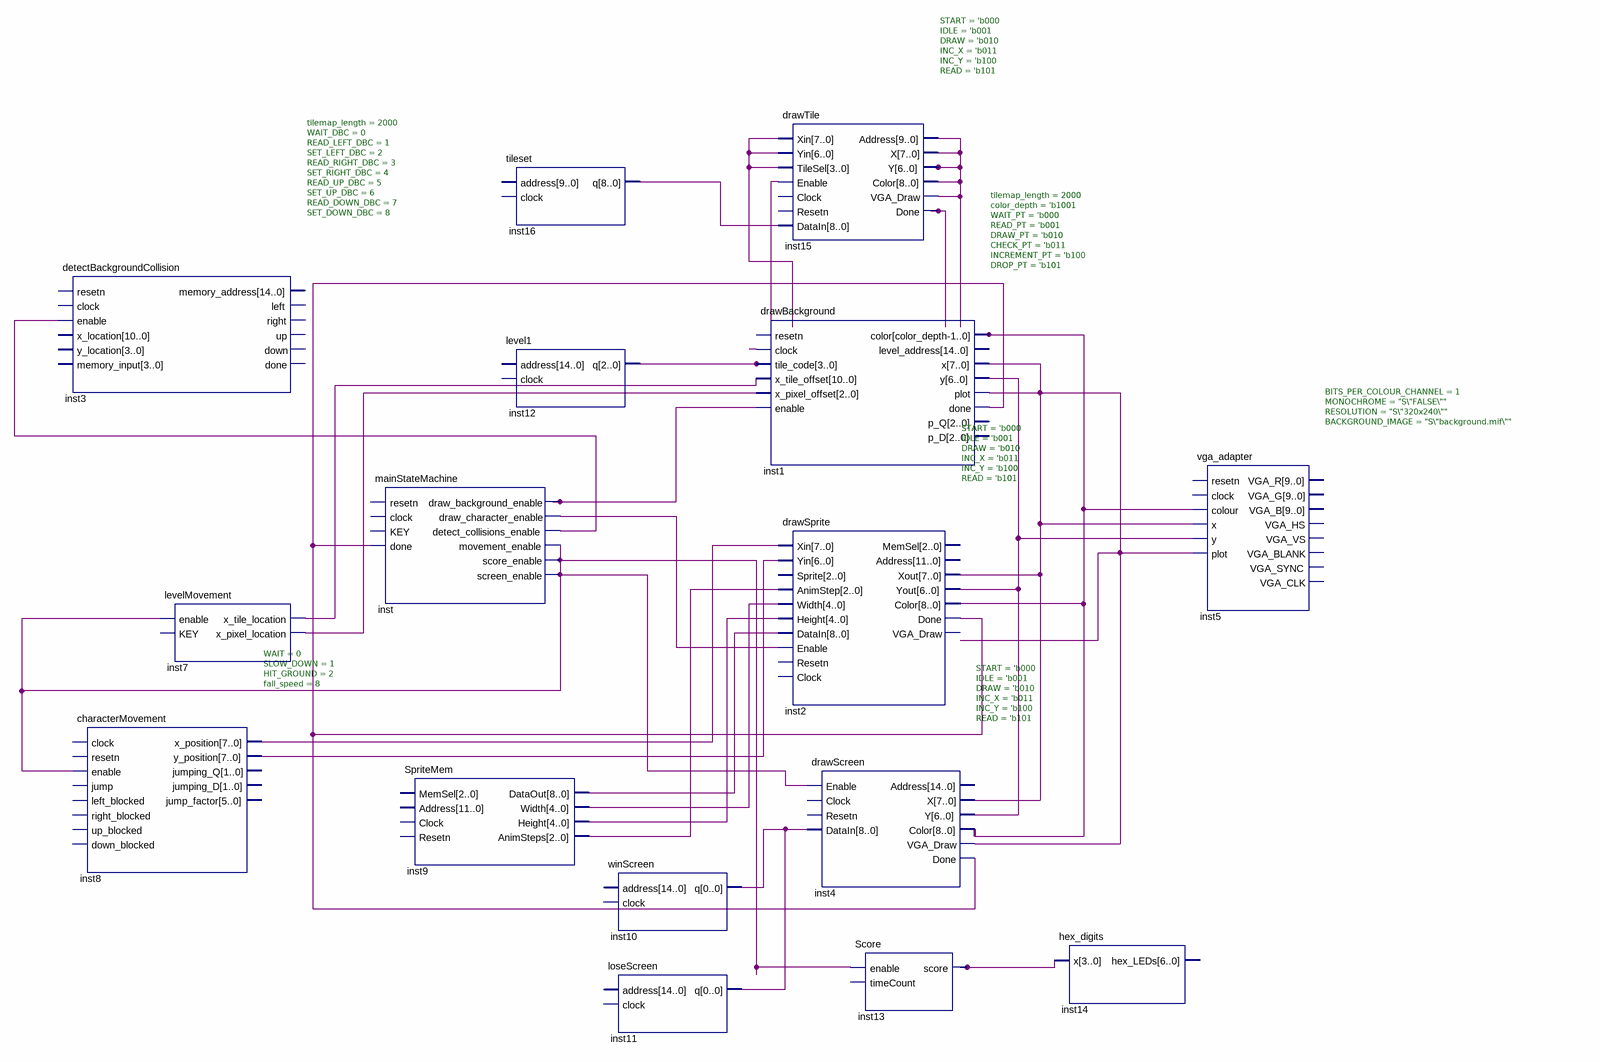
[diagram p0: schematic sheet]
// Quartus schematic Block.bdf as structural Verilog: 16 symbols, 0 pins
module Block (
);

  wire inst1_color, inst1_done, inst1_x, inst1_y, inst7_x_pixel_location, inst7_x_tile_location,
       inst8_y_position, inst10_q, inst12_q, inst13_score, inst15_address, inst15_done,
       inst_detect_collisions_enable, inst_draw_background_enable, inst_draw_character_enable,
       inst_movement_enable, undriven, undriven_2, undriven_3;
  wire [2:0] inst9_animsteps;
  wire [4:0] inst9_height, inst9_width;
  wire [7:0] inst8_x_position;
  wire [8:0] inst4_color, inst9_dataout, inst16_q;

  detectBackgroundCollision #(.tilemap_length(2000), .WAIT_DBC(0), .READ_LEFT_DBC(1), .SET_LEFT_DBC(2), .READ_RIGHT_DBC(3), .SET_RIGHT_DBC(4), .READ_UP_DBC(5), .SET_UP_DBC(6), .READ_DOWN_DBC(7), .SET_DOWN_DBC(8)) inst3 (.enable(inst_detect_collisions_enable));  // open: resetn, clock, x_location, y_location, memory_input, memory_address, left, right, up, down, done
  characterMovement #(.WAIT(0), .SLOW_DOWN(1), .HIT_GROUND(2), .fall_speed(8)) inst8 (
    .enable(inst_movement_enable), .x_position(inst8_x_position), .y_position(inst8_y_position));  // open: clock, resetn, jump, left_blocked, right_blocked, up_blocked, down_blocked, jumping_Q, jumping_D, jump_factor
  levelMovement inst7 (
    .enable(inst_movement_enable), .x_tile_location(inst7_x_tile_location),
    .x_pixel_location(inst7_x_pixel_location));  // open: KEY
  mainStateMachine inst (
    .done(inst1_done), .draw_background_enable(inst_draw_background_enable),
    .draw_character_enable(inst_draw_character_enable),
    .detect_collisions_enable(inst_detect_collisions_enable), .movement_enable(inst_movement_enable),
    .score_enable(inst_movement_enable), .screen_enable(inst_movement_enable));  // open: resetn, clock, KEY
  SpriteMem inst9 (
    .DataOut(inst9_dataout), .Width(inst9_width), .Height(inst9_height), .AnimSteps(inst9_animsteps));  // open: MemSel, Address, Clock, Resetn
  tileset inst16 (.q(inst16_q));  // open: address, clock
  level1 inst12 (.q(inst12_q));  // open: address, clock
  winScreen inst10 (.q(inst10_q));  // open: address, clock
  loseScreen inst11 (.q(inst10_q));  // open: address, clock
  drawBackground #(.tilemap_length(2000), .color_depth('b1001), .WAIT_PT('b000), .READ_PT('b001), .DRAW_PT('b010), .CHECK_PT('b011), .INCREMENT_PT('b100), .DROP_PT('b101)) inst1 (
    .clock(undriven), .tile_code({4{inst12_q}}), .x_tile_offset({11{inst7_x_tile_location}}),
    .x_pixel_offset({3{inst7_x_pixel_location}}), .enable(inst_draw_background_enable), .color(inst1_color),
    .x(inst1_x), .y(inst1_y), .plot(inst1_x), .done(inst1_done));  // open: resetn, level_address, p_Q, p_D
  drawTile #(.START('b000), .IDLE('b001), .DRAW('b010), .INC_X('b011), .INC_Y('b100), .READ('b101)) inst15 (
    .Xin({8{undriven_2}}), .Yin({7{undriven_2}}), .TileSel({4{undriven_2}}), .Enable(undriven_3),
    .DataIn(inst16_q), .Address(inst15_address), .X(inst15_address), .Y(inst15_address),
    .Color(inst15_address), .VGA_Draw(inst15_address), .Done(inst15_done));  // open: Clock, Resetn
  drawSprite #(.START('b000), .IDLE('b001), .DRAW('b010), .INC_X('b011), .INC_Y('b100), .READ('b101)) inst2 (
    .Xin(inst8_x_position), .Yin({7{inst8_y_position}}), .AnimStep(inst9_animsteps), .Width(inst9_width),
    .Height(inst9_height), .DataIn(inst9_dataout), .Enable(inst_draw_character_enable), .Xout(inst1_x),
    .Yout(inst1_y), .Color(inst1_color), .Done(inst1_done));  // open: Sprite, Resetn, Clock, MemSel, Address, VGA_Draw
  drawScreen #(.START('b000), .IDLE('b001), .DRAW('b010), .INC_X('b011), .INC_Y('b100), .READ('b101)) inst4 (
    .Enable(inst_movement_enable), .DataIn({9{inst10_q}}), .X(inst1_x), .Y(inst1_y), .Color(inst4_color),
    .VGA_Draw(inst1_x), .Done(inst1_done));  // open: Clock, Resetn, Address
  Score inst13 (.enable(inst_movement_enable), .score(inst13_score));  // open: timeCount
  hex_digits inst14 (.x({4{inst13_score}}));  // open: hex_LEDs
  vga_adapter #(.BITS_PER_COLOUR_CHANNEL(1), .MONOCHROME("S\"FALSE\""), .RESOLUTION("S\"320x240\""), .BACKGROUND_IMAGE("S\"background.mif\"")) inst5 (
    .colour(inst1_color), .x(inst1_x), .y(inst1_y), .plot(inst1_x));  // open: resetn, clock, VGA_R, VGA_G, VGA_B, VGA_HS, VGA_VS, VGA_BLANK, VGA_SYNC, VGA_CLK
endmodule
